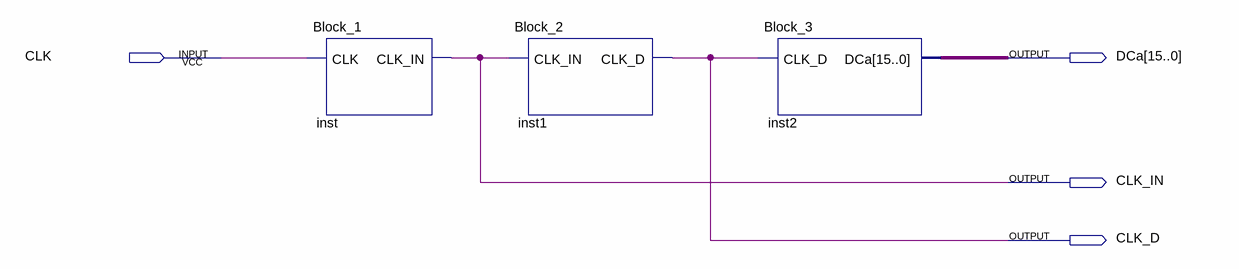
[diagram p0: schematic sheet]
// Quartus schematic Lab_2.bdf as structural Verilog: 3 symbols, 4 pins
module Lab_2 (
  input  CLK,
  output [15:0] DCa,
  output CLK_IN,
  output CLK_D
);

  Block_1 inst (.CLK(CLK), .CLK_IN(CLK_IN));
  Block_2 inst1 (.CLK_IN(CLK_IN), .CLK_D(CLK_D));
  Block_3 inst2 (.CLK_D(CLK_D), .DCa(DCa));
endmodule
